# EAGLE design MDM_V3_PotPad_A (EAGLE 6.4)
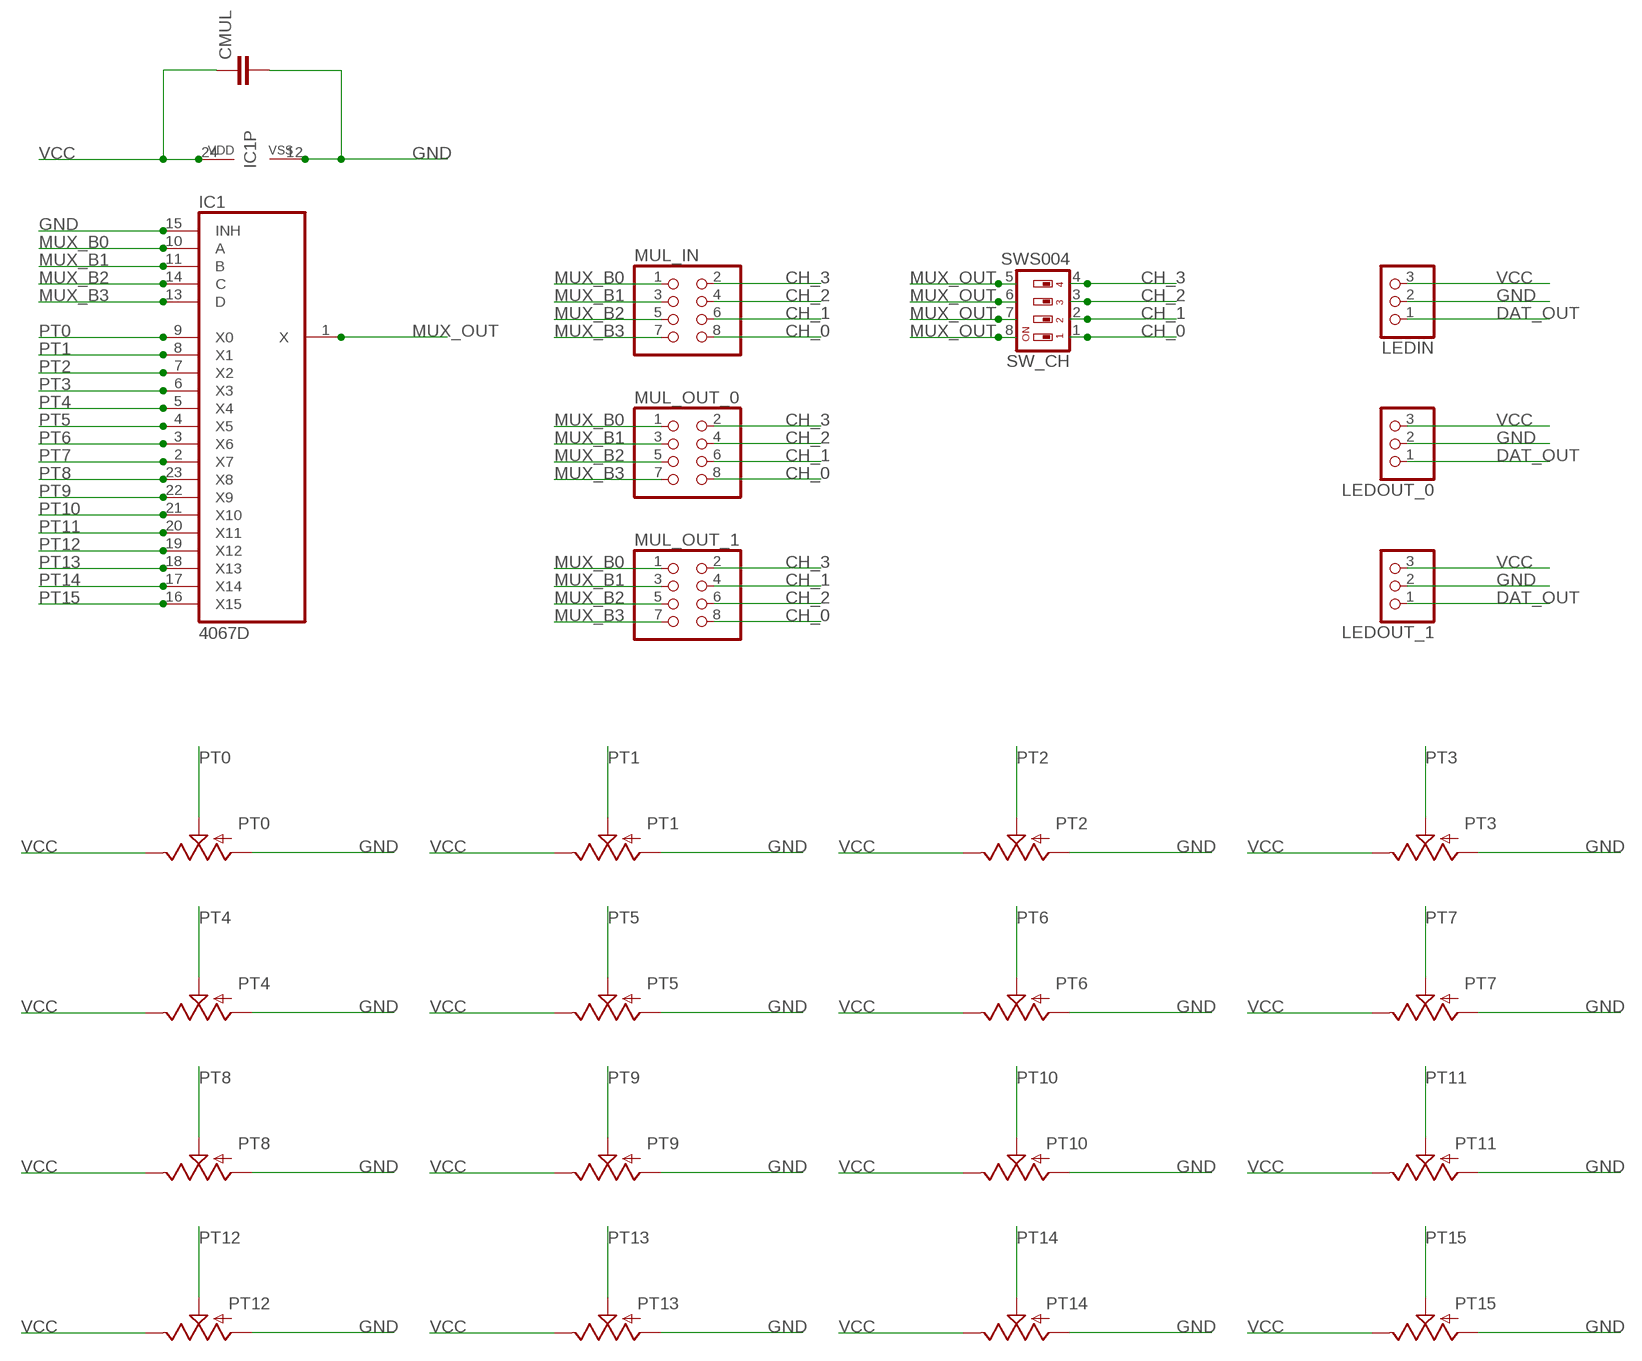
[diagram p0: schematic, sheet 1]

## Parts
CMUL  C-EUC1206K  [C1206K]
IC1  4067D  [SO24W]
LEDIN  PINHD-1X3  [1X03]
LEDOUT_0  PINHD-1X3  [1X03]
LEDOUT_1  PINHD-1X3  [1X03]
MUL_IN  PINHD-2X4  [2X04]
MUL_OUT_0  PINHD-2X4  [2X04]
MUL_OUT_1  PINHD-2X4  [2X04]
PT0  POT  [ALPS_POT]
PT1  POT  [ALPS_POT]
PT2  POT  [ALPS_POT]
PT3  POT  [ALPS_POT]
PT4  POT  [ALPS_POT]
PT5  POT  [ALPS_POT]
PT6  POT  [ALPS_POT]
PT7  POT  [ALPS_POT]
PT8  POT  [ALPS_POT]
PT9  POT  [ALPS_POT]
PT10  POT  [ALPS_POT]
PT11  POT  [ALPS_POT]
PT12  POT  [ALPS_POT]
PT13  POT  [ALPS_POT]
PT14  POT  [ALPS_POT]
PT15  POT  [ALPS_POT]
SW_CH  SWS004  [SMS-004]

## Nets
CH_0: MUL_IN.8 MUL_OUT_0.8 MUL_OUT_1.8 SW_CH.1
CH_1: MUL_IN.6 MUL_OUT_0.6 MUL_OUT_1.4 SW_CH.2
CH_2: MUL_IN.4 MUL_OUT_0.4 MUL_OUT_1.6 SW_CH.3
CH_3: MUL_IN.2 MUL_OUT_0.2 MUL_OUT_1.2 SW_CH.4
DAT_OUT: LEDIN.1 LEDOUT_0.1 LEDOUT_1.1
GND [GND]: CMUL.2 IC1.12(VSS) IC1.15(INH) LEDIN.2 LEDOUT_0.2 LEDOUT_1.2 PT0.P$3(A) PT1.P$3(A) PT2.P$3(A) PT3.P$3(A) PT4.P$3(A) PT5.P$3(A) PT6.P$3(A) PT7.P$3(A) PT8.P$3(A) PT9.P$3(A) PT10.P$3(A) PT11.P$3(A) PT12.P$3(A) PT13.P$3(A) PT14.P$3(A) PT15.P$3(A)
MUX_B0: IC1.10(A) MUL_IN.1 MUL_OUT_0.1 MUL_OUT_1.1
MUX_B1: IC1.11(B) MUL_IN.3 MUL_OUT_0.3 MUL_OUT_1.3
MUX_B2: IC1.14(C) MUL_IN.5 MUL_OUT_0.5 MUL_OUT_1.5
MUX_B3: IC1.13(D) MUL_IN.7 MUL_OUT_0.7 MUL_OUT_1.7
MUX_OUT: IC1.1(X) SW_CH.5 SW_CH.6 SW_CH.7 SW_CH.8
PT0: IC1.9(X0) PT0.P$2(S)
PT1: IC1.8(X1) PT1.P$2(S)
PT2: IC1.7(X2) PT2.P$2(S)
PT3: IC1.6(X3) PT3.P$2(S)
PT4: IC1.5(X4) PT4.P$2(S)
PT5: IC1.4(X5) PT5.P$2(S)
PT6: IC1.3(X6) PT6.P$2(S)
PT7: IC1.2(X7) PT7.P$2(S)
PT8: IC1.23(X8) PT8.P$2(S)
PT9: IC1.22(X9) PT9.P$2(S)
PT10: IC1.21(X10) PT10.P$2(S)
PT11: IC1.20(X11) PT11.P$2(S)
PT12: IC1.19(X12) PT12.P$2(S)
PT13: IC1.18(X13) PT13.P$2(S)
PT14: IC1.17(X14) PT14.P$2(S)
PT15: IC1.16(X15) PT15.P$2(S)
VCC: CMUL.1 IC1.24(VDD) LEDIN.3 LEDOUT_0.3 LEDOUT_1.3 PT0.P$1(E) PT1.P$1(E) PT2.P$1(E) PT3.P$1(E) PT4.P$1(E) PT5.P$1(E) PT6.P$1(E) PT7.P$1(E) PT8.P$1(E) PT9.P$1(E) PT10.P$1(E) PT11.P$1(E) PT12.P$1(E) PT13.P$1(E) PT14.P$1(E) PT15.P$1(E)

## Library data of the parts
CMUL = resistor:C-EU: CAPACITOR, European symbol
IC1 = 40xx:4067: 16-channel ANALOG MULTIPLEXER
LEDIN LEDOUT_0 LEDOUT_1 = adafruit:PINHD-1X3: PIN HEADER
MUL_IN MUL_OUT_0 MUL_OUT_1 = pinhead:PINHD-2X4: PIN HEADER
PT0 PT1-PT15 = SparkFun-Electromechanical:POT
SW_CH = smd-special:SWS004: SMD Dip Switch 4 pol.

## Net classes
1 GND: width 0.635 mm, clearance 0.254 mm

## Board
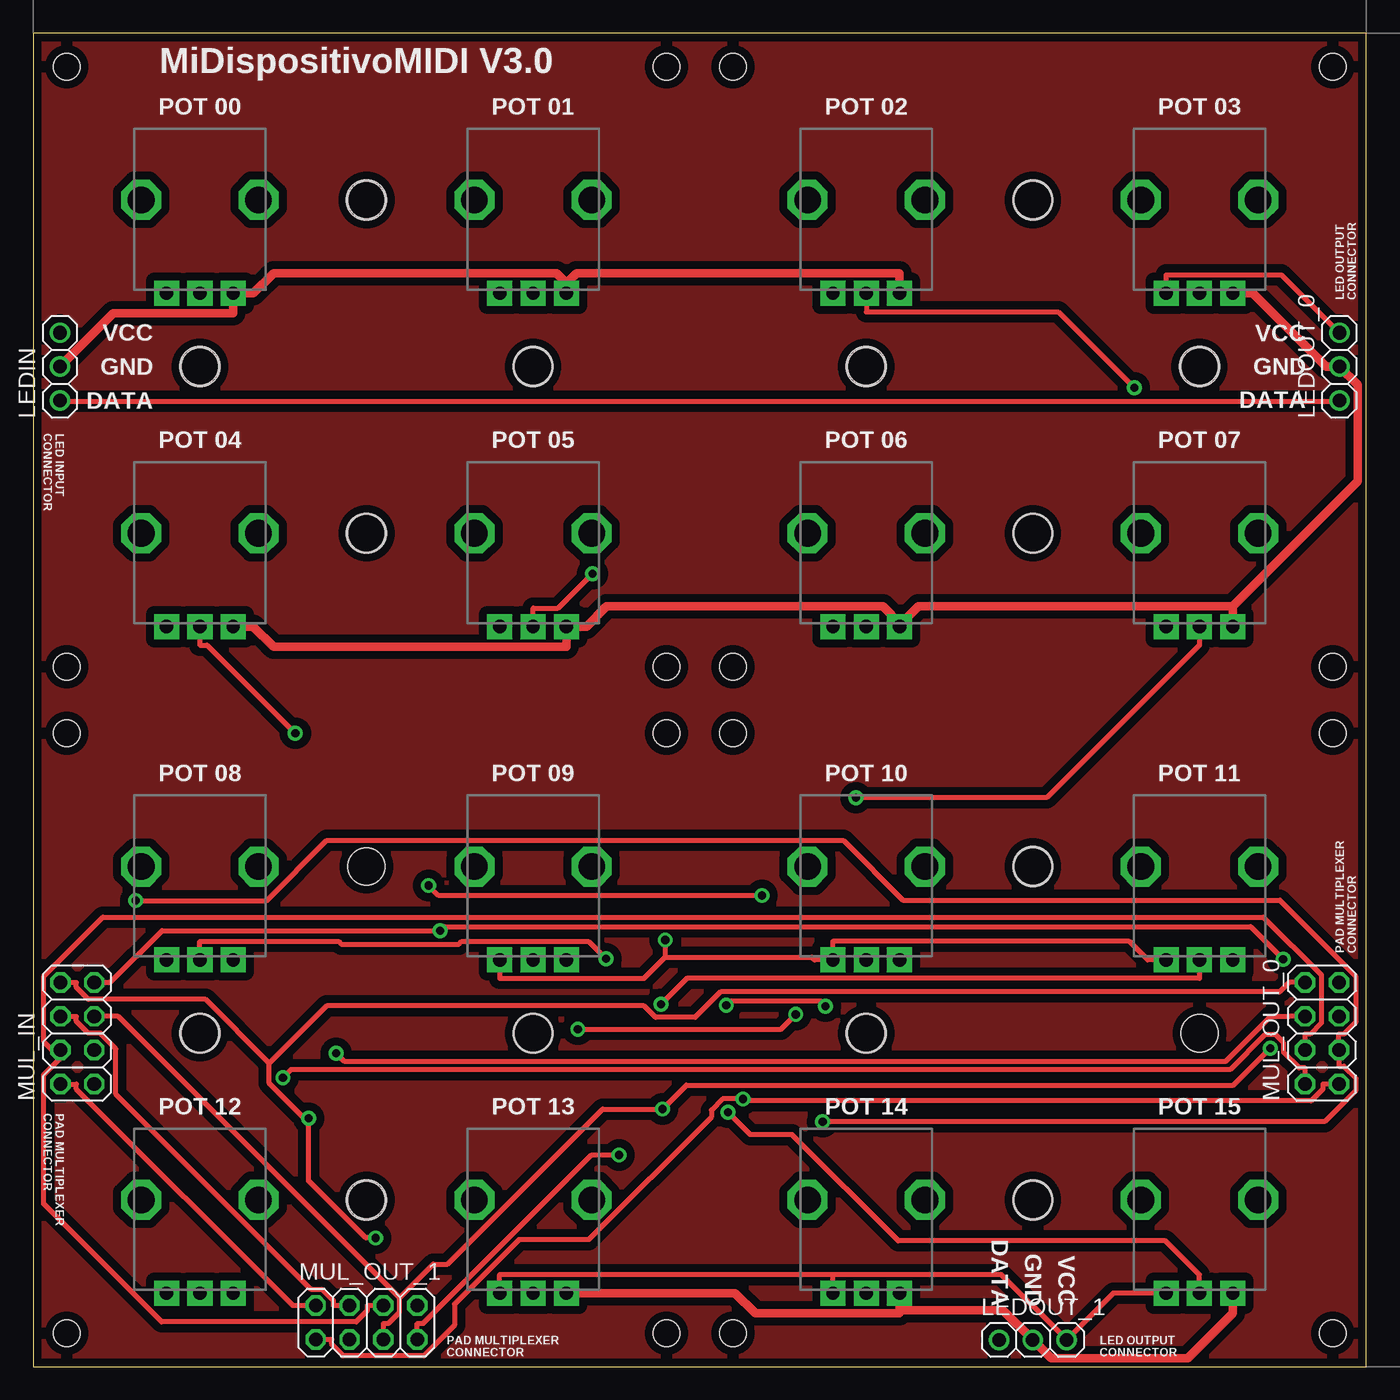
[diagram p1: board, top side]
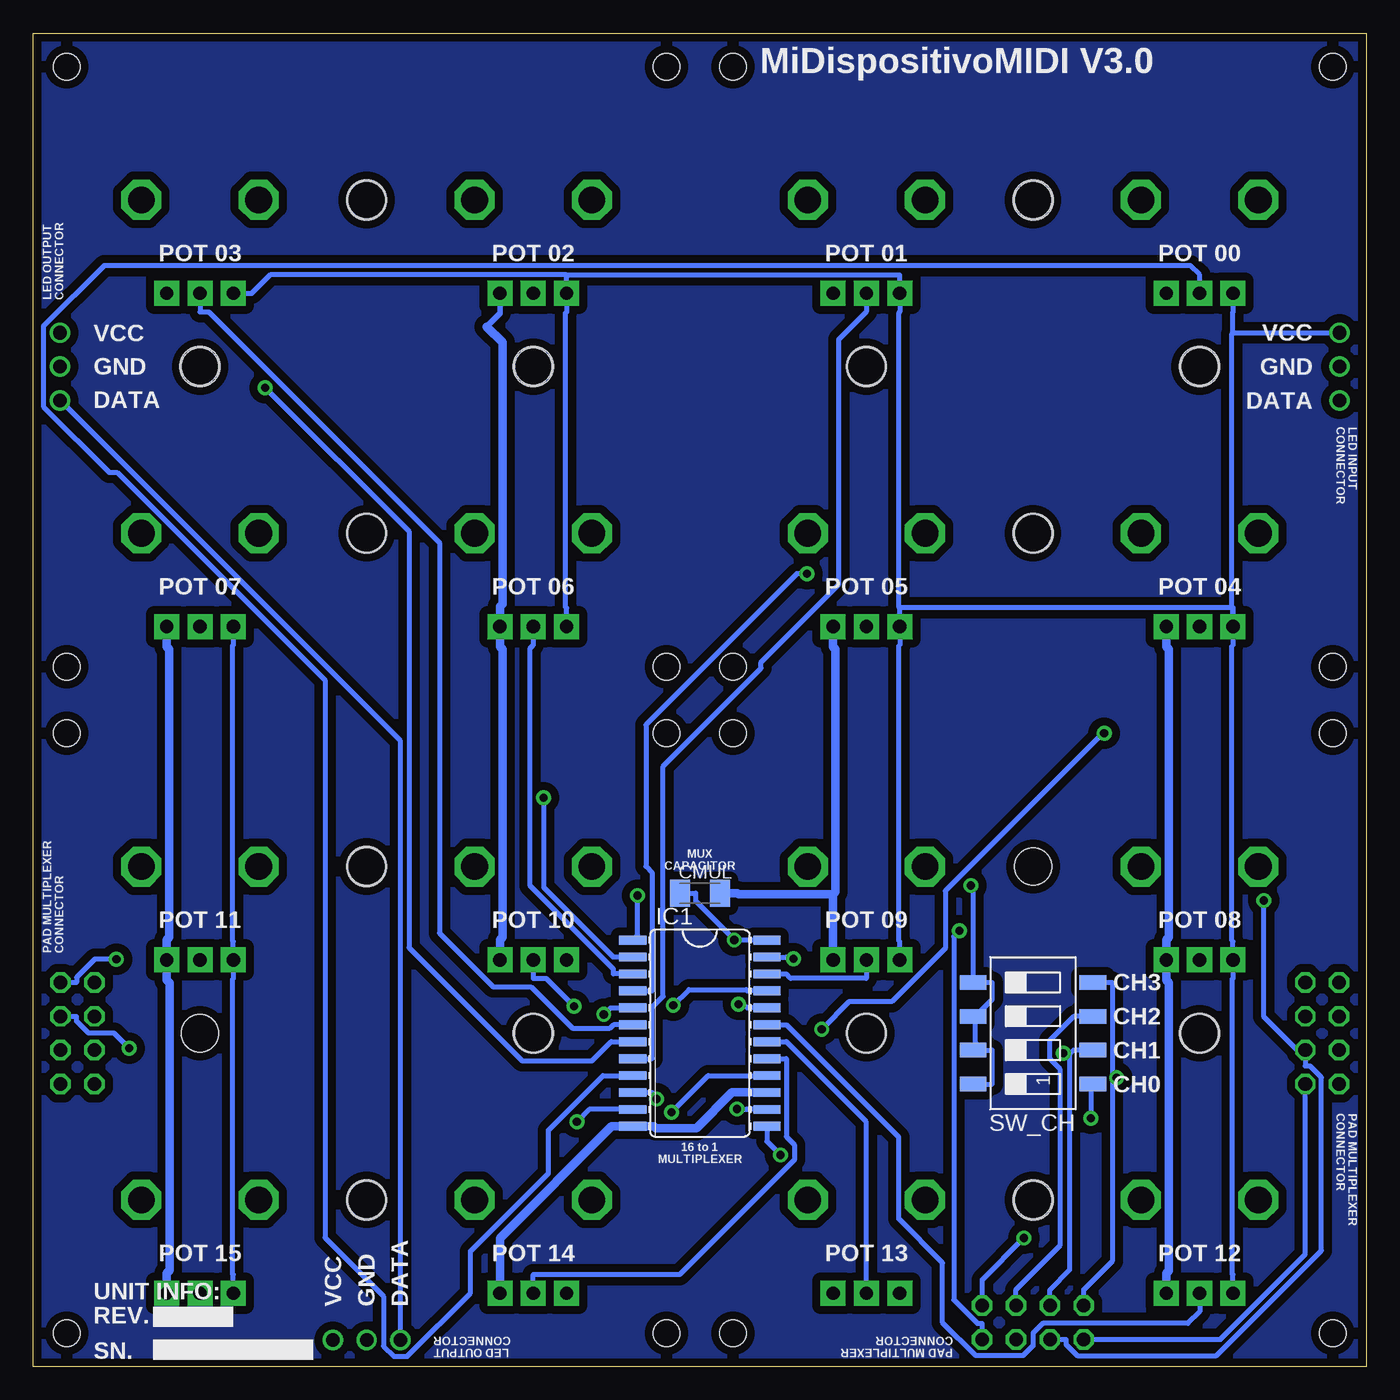
[diagram p2: board, bottom side, seen from below]

Size 100 x 100 mm. Coordinates in mm from the lower left corner, seen from the top.
Outline: 0,0 100,0
Outline: 100,0 100,100
Outline: 100,100 0,100
Outline: 0,100 0,0
Outline: 0,0 100,0
Outline: 100,0 100,100
Outline: 100,100 0,100
Outline: 0,100 0,0
Copper layers (1*16): Top 0.035mm / dielectric 1.5mm / Bottom 0.035mm
Design rules "default *": minimum track width 15mil, minimum drill 24mil, track to track 10mil, track to pad 10mil, pad to pad 10mil, via to via 10mil, smd to smd 8mil, copper to edge 8mil, drill to drill 8mil, minimum pad ring 10mil, minimum via ring 10mil, stop-mask expansion 4mil, vias tented up to drill 0mil, thermal gap 10mil
Holes 2.8 mm at 25,87.5 75,87.5 75,62.5 25,62.5 25,37.5 25,12.5 75,12.5 75,37.5 37.5,25 87.5,25 62.5,25 12.5,25 12.5,75 37.5,75 62.5,75 87.5,75 25,87.5 75,87.5 75,62.5 25,62.5 25,37.5 25,12.5 75,12.5 75,37.5 37.5,25 87.5,25 62.5,25 12.5,25 12.5,75 37.5,75 62.5,75 87.5,75
Holes 3 mm at 25,87.5 12.5,75 37.5,75 25,62.5 25,12.5 12.5,25 37.5,25 75,12.5 62.5,25 75,37.5 75,87.5 75,62.5 87.5,75 62.5,75 37.5,75 12.5,75 25,87.5 12.5,75 37.5,75 25,62.5 25,12.5 12.5,25 37.5,25 75,12.5 62.5,25 75,37.5 75,87.5 75,62.5 87.5,75 62.5,75 37.5,75 12.5,75
Holes 2 mm at 47.5,52.5 52.5,47.5 2.5,47.5 47.5,47.5 97.5,47.5 2.5,52.5 47.5,2.5 47.5,97.5 52.5,97.5 2.5,97.5 2.5,52.5 2.5,47.5 52.5,52.5 2.5,2.5 52.5,2.5 97.5,2.5 97.5,52.5 97.5,97.5

### Footprints (pad centres in the part's own frame; a part is rotated, then mirrored left to right if it is on the bottom)
C1206K = smd 1.5 x 2: 1 -1.5,0; 2 1.5,0
SO24W = smd 0.66 x 2.032: 1 -6.985,-5.029; 2 -5.715,-5.029; 3 -4.445,-5.029; 4 -3.175,-5.029; 5 -1.905,-5.029; 6 -0.635,-5.029; 7 0.635,-5.029; 8 1.905,-5.029; 9 3.175,-5.029; 10 4.445,-5.029; 11 5.715,-5.029; 12 6.985,-5.029; 13 6.985,5.029; 14 5.715,5.029; 15 4.445,5.029; 16 3.175,5.029; 17 1.905,5.029; 18 0.635,5.029; 19 -0.635,5.029; 20 -1.905,5.029; 21 -3.175,5.029; 22 -4.445,5.029; 23 -5.715,5.029; 24 -6.985,5.029
1X03 = drill 1.016: 1 -2.54,0; 2 0,0; 3 2.54,0
2X04 = drill 1.016 octagon: 1 -3.81,-1.27; 2 -3.81,1.27; 3 -1.27,-1.27; 4 -1.27,1.27; 5 1.27,-1.27; 6 1.27,1.27; 7 3.81,-1.27; 8 3.81,1.27
ALPS_POT = drill 1 pad 1.88 square: P$1 7,-2.5; P$2 7,0; P$3 7,2.5 | drill 2 octagon: P$4 0,-4.4; P$5 0,4.4
SMS-004 = smd 1.092 x 2.007: 1 -3.81,-4.496; 2 -1.27,-4.496; 3 1.27,-4.496; 4 3.81,-4.496; 5 3.81,4.496; 6 1.27,4.496; 7 -1.27,4.496; 8 -3.81,4.496

### Placement (x,y rotation side)
CMUL  50,35.5 0 bottom
IC1  50,25 270 bottom
LEDIN  2,75 90 top
LEDOUT_0  98,75 90 top
LEDOUT_1  75,2 0 top
MUL_IN  3.3,25 90 top
MUL_OUT_0  96.7,25 90 top
MUL_OUT_1  25,3.3 0 top
PT0  12.5,87.5 270 top
PT1  37.5,87.5 270 top
PT2  62.5,87.5 270 top
PT3  87.5,87.5 270 top
PT4  12.5,62.5 270 top
PT5  37.5,62.5 270 top
PT6  62.5,62.5 270 top
PT7  87.5,62.5 270 top
PT8  12.5,37.5 270 top
PT9  37.5,37.5 270 top
PT10  62.5,37.5 270 top
PT11  87.5,37.5 270 top
PT12  12.5,12.5 270 top
PT13  37.5,12.5 270 top
PT14  62.5,12.5 270 top
PT15  87.5,12.5 270 top
SW_CH  25,25 90 bottom

### Tracks (layer width: path | path; a pad name or v marks a point on that pad's centre or on a via)
CH_0  (via drill 0.61 pad 1.12)
  Top 0.381: v25.69,9.64 24.94,9.64 20.66,13.92 v20.66,18.62 20.33,18.62 17.71,21.24 17.71,22.75 | 17.71,22.75 12.92,27.54 4.13,27.54 3.24,28.43 3.24,28.81 MUL_IN.8 | 17.71,22.75 22.02,27.06 45.81,27.06 46.69,26.18 49.66,26.18 51.58,28.1 93.51,28.1 94.22,28.81 MUL_OUT_0.8
  Bottom 0.381: MUL_OUT_1.8 28.81,6.52 v25.69,9.64 | SW_CH.1 20.66,21.04 v20.66,18.62
CH_1  (via drill 0.61 pad 1.12)
  Top 0.381: MUL_IN.6 3.24,26.27 3.24,25.89 4.13,25 5.02,25 6.19,23.83 6.19,20.44 20.85,5.78 21.69,5.78 22.52,4.95 22.52,4.57 MUL_OUT_1.4 | MUL_OUT_0.6 94.22,26.27 92.85,26.27 89.48,22.9 23.33,22.9 v22.73,23.5
  Bottom 0.381: 22.26,23.46 22.26,7.25 23.73,5.78 MUL_OUT_1.4 | 22.26,23.46 22.22,23.46 21.95,23.73 SW_CH.2 | 22.26,23.46 22.69,23.46 v22.73,23.5
CH_2
  Top 0.381: MUL_OUT_1.6 25.06,4.57 25.06,4.19 24.23,3.36 9.62,3.36 0.77,12.2 0.77,21.87 2.03,23.13 | MUL_OUT_0.4 95.43,24.94 95.81,24.94 96.64,25.78 96.64,29.37 92.3,33.71 5.22,33.71 0.79,29.28 0.79,24.37 2.03,23.13 | MUL_IN.4 2.03,23.13
  Bottom 0.381: MUL_OUT_1.6 26.27,5.78 22.95,9.1 22.95,22.3 23.74,23.09 23.74,24.49 21.95,26.27 SW_CH.3
CH_3  (via drill 0.61 pad 1.12)
  Top 0.381: MUL_IN.2 3.24,21.19 3.24,20.82 19.48,4.57 MUL_OUT_1.2 | v18.73,21.67 19.32,22.27 89.8,22.27 92.41,24.87 93.24,24.87 93.83,24.29 93.83,23.55 94.98,22.4 95.43,22.4 MUL_OUT_0.2
  Bottom 0.381: 19.06,21.67 19.06,7.91 21.19,5.78 MUL_OUT_1.2 | 19.06,21.67 19.06,28.81 SW_CH.4 | 19.06,21.67 v18.73,21.67
DAT_OUT
  Top 0.381: LEDIN.1 2.04,72.42 97.96,72.42 LEDOUT_0.1
  Bottom 0.381: LEDOUT_1.1 72.46,46.92 LEDOUT_0.1
GND
  Top 0.635: 90,57.01 99.38,66.39 99.38,73.62 LEDOUT_0.2 97.01,75 91.51,80.5 PT3.P$3 | 65.07,55.68 66.41,57.01 90,57.01 | 65,4.23 65,3.99 54.17,3.99 52.66,5.5 PT13.P$3 | PT14.P$3 65,4.23 | 65,4.23 72.77,4.23 LEDOUT_1.2 76.38,0.62 86.64,0.62 90,3.99 PT15.P$3 | 40,81.26 39.24,82.01 18.02,82.01 16.51,80.5 PT0.P$3 15,78.99 5.99,78.99 LEDIN.2 | 40,81.26 40.76,82.01 65,82.01 PT2.P$3 | PT4.P$3 16.51,55.5 18.02,53.99 40,53.99 PT5.P$3 41.51,55.5 43.02,57.01 63.74,57.01 65.07,55.68 | 65.07,55.68 65,55.6 PT6.P$3 | PT1.P$3 40,81.26 | PT7.P$3 90,57.01
  Bottom 0.406: PT2.P$3 65,79 66,78
  Bottom 0.635: PT15.P$3 90,7.01 89.79,7.22 89.79,28.77 90,28.99 PT11.P$3 90,32.01 89.81,32.2 89.81,53.8 90,53.99 PT7.P$3 | 40,35.42 47.1,35.42 47.18,35.5 CMUL.2 | 40,35.42 39.81,35.6 39.81,53.8 40,53.99 PT5.P$3 | 40,35.42 40,32.01 PT9.P$3 | PT4.P$3 15,53.99 14.81,53.8 14.81,32.2 15,32.01 PT8.P$3 15,28.99 14.81,28.8 14.81,7.2 15,7.01 PT12.P$3 | PT14.P$3 65,9.63 56.62,18.02 IC1.12 53.44,18.02 53.31,17.89 50.27,17.89 47.6,20.55 IC1.15 | 66,78 64.82,76.82 64.82,57.2 65,57.01 PT6.P$3 65,54.74 65,53.99 64.81,53.8 64.81,32.2 65,32.01 PT10.P$3
MUX_B0  (via drill 0.61 pad 1.12)
  Top 0.381: MUL_OUT_0.1 96.76,21.19 96.76,20.82 95.88,19.93 53.37,19.93 v53.24,20.07 53.23,20.08 51.72,20.08 50.87,19.23 50.87,18.71 41.67,9.51 36.43,9.51 31.6,4.69 31.6,3.09 29.32,0.81 23.24,0.81 22.4,1.65 22.4,2.03 MUL_OUT_1.1
  Bottom 0.381: IC1.10 53.57,20.55 53.57,20.4 v53.24,20.07 | MUL_OUT_1.1 10.95,2.03 4.57,8.4 MUL_IN.1
MUX_B1  (via drill 0.61 pad 1.12)
  Top 0.381: v7.67,34.95 17.51,34.95 22.02,39.47 60.78,39.47 65.27,34.98 93.53,34.98 99.22,29.29 99.22,25.81 98.34,24.94 97.97,24.94 MUL_OUT_0.3 97.97,22.52 98.34,22.52 99.22,21.65 99.22,20.68 96.9,18.36 v59.23,18.36
  Bottom 0.381: 4.57,23.13 7.67,26.23 v7.67,34.95 | 4.57,23.13 4.57,22.52 4.2,22.52 3.36,21.68 3.36,8.69 11.23,0.82 21.69,0.82 22.52,1.65 22.52,2.03 MUL_OUT_1.3 | MUL_IN.3 4.57,23.13 | IC1.11 58.31,19.29 v59.23,18.36
MUX_B2  (via drill 0.61 pad 1.12)
  Top 0.381: 27.48,5.15 30,7.68 31.07,7.68 42.71,19.32 v47.22,19.32 49.01,21.1 90.05,21.1 v92.82,23.87 | 27.48,5.15 27.48,4.07 26.65,3.24 26.27,3.24 MUL_OUT_1.5 | 27.48,5.15 6.36,26.27 MUL_IN.5
  Bottom 0.381: MUL_OUT_0.5 96.76,26.27 96.76,25.89 95.87,25 93.95,25 v92.82,23.87 | IC1.14 46.43,19.29 46.46,19.32 v47.22,19.32
MUX_B3  (via drill 0.61 pad 1.12)
  Top 0.381: v93.78,30.56 91.34,33 30.83,33 v30.52,32.69 9.65,32.69 5.78,28.81 MUL_IN.7 | MUL_OUT_1.7 28.81,3.24 29.26,3.24 41.89,15.87 v43.95,15.87
  Bottom 0.381: MUL_OUT_0.7 96.76,28.81 96.76,29.18 95.39,30.56 v93.78,30.56 | IC1.13 44.97,16.89 v43.95,15.87 | MUL_OUT_1.7 28.81,3.24 29.18,3.24 30.94,5 30.94,32.26 v30.52,32.69
MUX_OUT  (via drill 0.61 pad 1.12)
  Top 0.381: v54.66,35.33 30.42,35.33 v29.67,36.08
  Bottom 0.381: IC1.1 54.66,32.35 v54.66,35.33 | 29.32,26.27 28.05,27.54 28.05,28.81 SW_CH.5 29.5,35.91 v29.67,36.08 | 29.32,26.27 SW_CH.6 | 28.77,23.73 29.32,24.27 29.32,26.27 | 28.77,23.73 28.05,23.73 28.05,21.19 SW_CH.8 | SW_CH.7 28.77,23.73
N$1
  pour Top (isolate 0.61): 0,100 0,0 100,0 100,100
N$2
  pour Bottom (isolate 0.61): 0,100 0,0 100,0 100,100
PT0
  Bottom 0.381: PT0.P$2 12.5,81.88 13.2,82.58 94.7,82.58 99.25,78.03 99.25,72 94.33,67.08 93.72,67.08 78.13,51.48 78.13,9.67 73.73,5.27 73.73,1.53 72.95,0.75 71.95,0.75 67.21,5.5 67.21,8.65 61.37,14.49 61.37,17.73 57.27,21.82 IC1.9
PT1
  Bottom 0.381: IC1.8 53.57,23.09 53.57,26.94 52.76,27.75 52.76,45.02 45.4,52.38 45.4,52.83 39.57,58.66 39.57,77.05 37.5,79.12 PT1.P$2
PT2  (via drill 0.61 pad 1.12)
  Top 0.381: PT2.P$2 62.5,79.12 76.91,79.12 v82.6,73.42
  Bottom 0.381: v82.6,73.42 71.83,62.64 71.83,31.43 63.32,22.92 58.1,22.92 56.65,24.36 IC1.7
PT3
  Bottom 0.381: IC1.6 56.49,25.64 56.75,25.38 59.56,25.38 62.67,28.48 65.51,28.48 69.54,32.51 69.54,61.8 86.85,79.12 87.5,79.12 PT3.P$2
PT4  (via drill 0.61 pad 1.12)
  Top 0.381: PT4.P$2 12.5,54.12 13.04,54.12 v19.66,47.49 | v40.85,25.3 56.1,25.3 v57.21,26.41
  Bottom 0.381: v57.21,26.41 56.71,26.91 IC1.5 | v19.66,47.49 19.75,47.49 31.58,35.67 31.58,31.37 35.59,27.36 38.8,27.36 v40.85,25.3
PT5  (via drill 0.61 pad 1.12)
  Top 0.381: PT5.P$2 37.5,56.88 39.37,56.88 v41.96,59.47
  Bottom 0.381: IC1.4 53.57,28.18 53.57,37.02 54.06,37.51 54.06,48.13 42.72,59.47 v41.96,59.47
PT6
  Bottom 0.381: PT6.P$2 62.5,54.12 62.73,53.89 62.73,36.05 56.49,29.81 56.49,29.45 IC1.3
PT7  (via drill 0.61 pad 1.12)
  Top 0.381: PT7.P$2 87.5,54.12 76.05,42.67 v61.72,42.67
  Bottom 0.381: IC1.2 56.49,30.71 61.72,35.95 v61.72,42.67
PT8  (via drill 0.61 pad 1.12)
  Top 0.381: PT8.P$2 12.5,31.88 22.89,31.88 23.1,31.68 31.94,31.68 32.15,31.88 41.65,31.88 v42.96,30.58
  Bottom 0.381: IC1.23 43.51,30.71 43.37,30.58 v42.96,30.58
PT9
  Bottom 0.381: IC1.22 43.51,29.45 43.18,29.12 37.5,29.12 PT9.P$2
PT10  (via drill 0.61 pad 1.12)
  Top 0.381: v59.45,27.03 59.07,27.41 52.31,27.41 v52,27.1
  Bottom 0.381: PT10.P$2 62.5,29.12 61.53,29.12 v59.45,27.03 | IC1.21 46.43,28.18 46.52,28.27 50.83,28.27 v52,27.1
PT11  (via drill 0.61 pad 1.12)
  Top 0.381: PT11.P$2 87.5,29.12 49.03,29.12 v47.1,27.18
  Bottom 0.381: IC1.20 46.43,26.91 46.71,27.18 v47.1,27.18
PT12
  Bottom 0.381: IC1.19 43.51,25.64 35.08,17.2 35.08,11.07 31.79,7.78 31.79,3.3 29.3,0.81 25.75,0.81 25,1.56 25,2.5 24.26,3.24 13.38,3.24 12.5,4.12 PT12.P$2
PT13
  Bottom 0.381: IC1.18 43.51,24.36 37.5,18.36 PT13.P$2
PT14
  Bottom 0.381: IC1.17 43.51,23.09 43.51,17.24 42.9,16.63 42.9,15.5 51.51,6.88 62.5,6.88 PT14.P$2
PT15  (via drill 0.61 pad 1.12)
  Top 0.381: PT15.P$2 87.5,6.88 84.95,9.43 64.89,9.43 56.93,17.4 53.81,17.4 v52.13,19.07
  Bottom 0.381: v52.13,19.07 49.38,21.82 IC1.16
VCC  (via drill 0.61 pad 1.12)
  Top 0.381: PT11.P$1 83.62,30.5 82.23,31.88 60,31.88 PT10.P$1 58.62,30.5 58.4,30.71 47.41,30.71 | 47.41,30.71 45.82,29.12 35,29.12 PT9.P$1 | v47.41,31.99 47.41,30.71 | PT3.P$1 85,81.88 93.66,81.88 LEDOUT_0.3 | PT13.P$1 35,6.88 60,6.88 | 60,6.88 72.66,6.88 LEDOUT_1.3 81.04,5.5 PT15.P$1 | PT14.P$1 60,6.88
  Bottom 0.381: 60,81.88 35,81.88 PT1.P$1 35,79.12 35.06,79.06 35.06,56.94 35,56.88 | 60,81.88 60,81.73 PT2.P$1 60,79.12 60.09,79.02 60.09,56.98 60,56.88 PT6.P$1 | PT9.P$1 35,31.88 35.07,31.95 35.07,54.05 35,54.12 PT5.P$1 35,56.88 | IC1.24 46.43,31.98 46.44,31.99 v47.41,31.99 50.3,34.88 50.3,35.5 CMUL.1 | 35,56.88 34.99,56.9 10.08,56.9 10.08,77.46 10,77.54 | 10,77.54 LEDIN.3 | 10,77.54 10,79.12 PT0.P$1 | PT3.P$1 83.62,80.5 82.23,81.88 60,81.88 | PT15.P$1 85,6.88 85.07,6.95 85.07,29.05 85,29.12 PT11.P$1 85,31.88 85.07,31.95 85.07,54.05 85,54.12 PT7.P$1 | PT4.P$1 10,54.12 10.07,54.05 10.07,31.95 10,31.88 PT8.P$1 10,29.81 10,29.12 10.06,29.06 10.06,6.94 10,6.88 PT12.P$1
  Bottom 0.406: 10.08,56.9 10,56.9 PT4.P$1

### Text on the board
_tsilk: MiDispositivoMIDI V3.0 | POT 00 | POT 01 | POT 02 | POT 03 | LED OUTPUT / CONNECTOR | VCC | VCC / GND / DATA | GND | DATA | LED INPUT / CONNECTOR | POT 04 | POT 05 | POT 06 | POT 07 | POT 08 | POT 09 | POT 10 | POT 11 | PAD MULTIPLEXER / CONNECTOR | POT 12 | POT 13 | POT 14 | POT 15 | PAD MULTIPLEXER / CONNECTOR | DATA | GND | VCC | PAD MULTIPLEXER / CONNECTOR | LED OUTPUT / CONNECTOR
_bsilk: MiDispositivoMIDI V3.0 | POT 00 | POT 01 | POT 02 | POT 03 | LED OUTPUT / CONNECTOR | VCC | VCC / GND / DATA | GND | DATA | LED INPUT / CONNECTOR | POT 04 | POT 05 | POT 06 | POT 07 | MUX / CAPACITOR | POT 08 | POT 09 | POT 10 | POT 11 | PAD MULTIPLEXER / CONNECTOR | CH3 / CH2 / CH1 / CH0 | PAD MULTIPLEXER / CONNECTOR | 16 to 1 / MULTIPLEXER | POT 12 | POT 13 | POT 14 | POT 15 | UNIT INFO: | DATA | GND | VCC | PAD MULTIPLEXER / CONNECTOR | LED OUTPUT / CONNECTOR | REV. / SN.